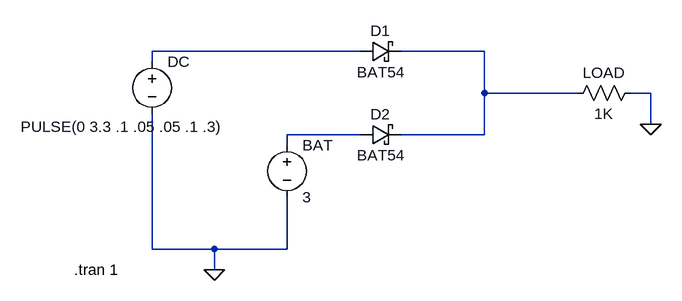
[diagram p0: schematic USB_and_BATT_DC_Switch_with_Schottky.asc]
USB_and_BATT_DC_Switch_with_Schottky.asc, the LTspice schematic file:
Version 4
SHEET 1 880 680
WIRE -16 112 -336 112
WIRE 176 112 48 112
WIRE -336 128 -336 112
WIRE 176 176 176 112
WIRE 320 176 176 176
WIRE 432 176 400 176
WIRE 432 224 432 176
WIRE -16 240 -128 240
WIRE 176 240 176 176
WIRE 176 240 48 240
WIRE -128 256 -128 240
WIRE -336 416 -336 208
WIRE -240 416 -336 416
WIRE -128 416 -128 336
WIRE -128 416 -240 416
WIRE -240 448 -240 416
FLAG 432 224 0
FLAG -240 448 0
SYMBOL schottky -16 128 R270
WINDOW 0 32 32 VTop 2
WINDOW 3 0 32 VBottom 2
SYMATTR InstName D1
SYMATTR Value BAT54
SYMBOL schottky -16 256 R270
WINDOW 0 32 32 VTop 2
WINDOW 3 0 32 VBottom 2
SYMATTR InstName D2
SYMATTR Value BAT54
SYMBOL voltage -336 112 R0
WINDOW 3 -202 116 Left 2
SYMATTR Value PULSE(0 3.3 .1 .05 .05 .1 .3)
SYMATTR InstName DC
SYMBOL voltage -128 240 R0
SYMATTR InstName BAT
SYMATTR Value 3
SYMBOL res 416 160 R90
WINDOW 0 0 56 VBottom 2
WINDOW 3 32 56 VTop 2
SYMATTR InstName LOAD
SYMATTR Value 1K
TEXT -456 448 Left 2 !.tran 1

The netlist it stands for:
* USB_and_BATT_DC_Switch_with_Schottky.asc
D1 N001 N002 BAT54
D2 N003 N002 BAT54
V§DC N001 0 PULSE(0 3.3 .1 .05 .05 .1 .3)
V§BAT N003 0 3
R§LOAD 0 N002 1K
.model D D
.lib standard.dio
.tran 1
.backanno
.end